# EAGLE schematic Rocketometer2148 MPU6050 (EAGLE 6.2)
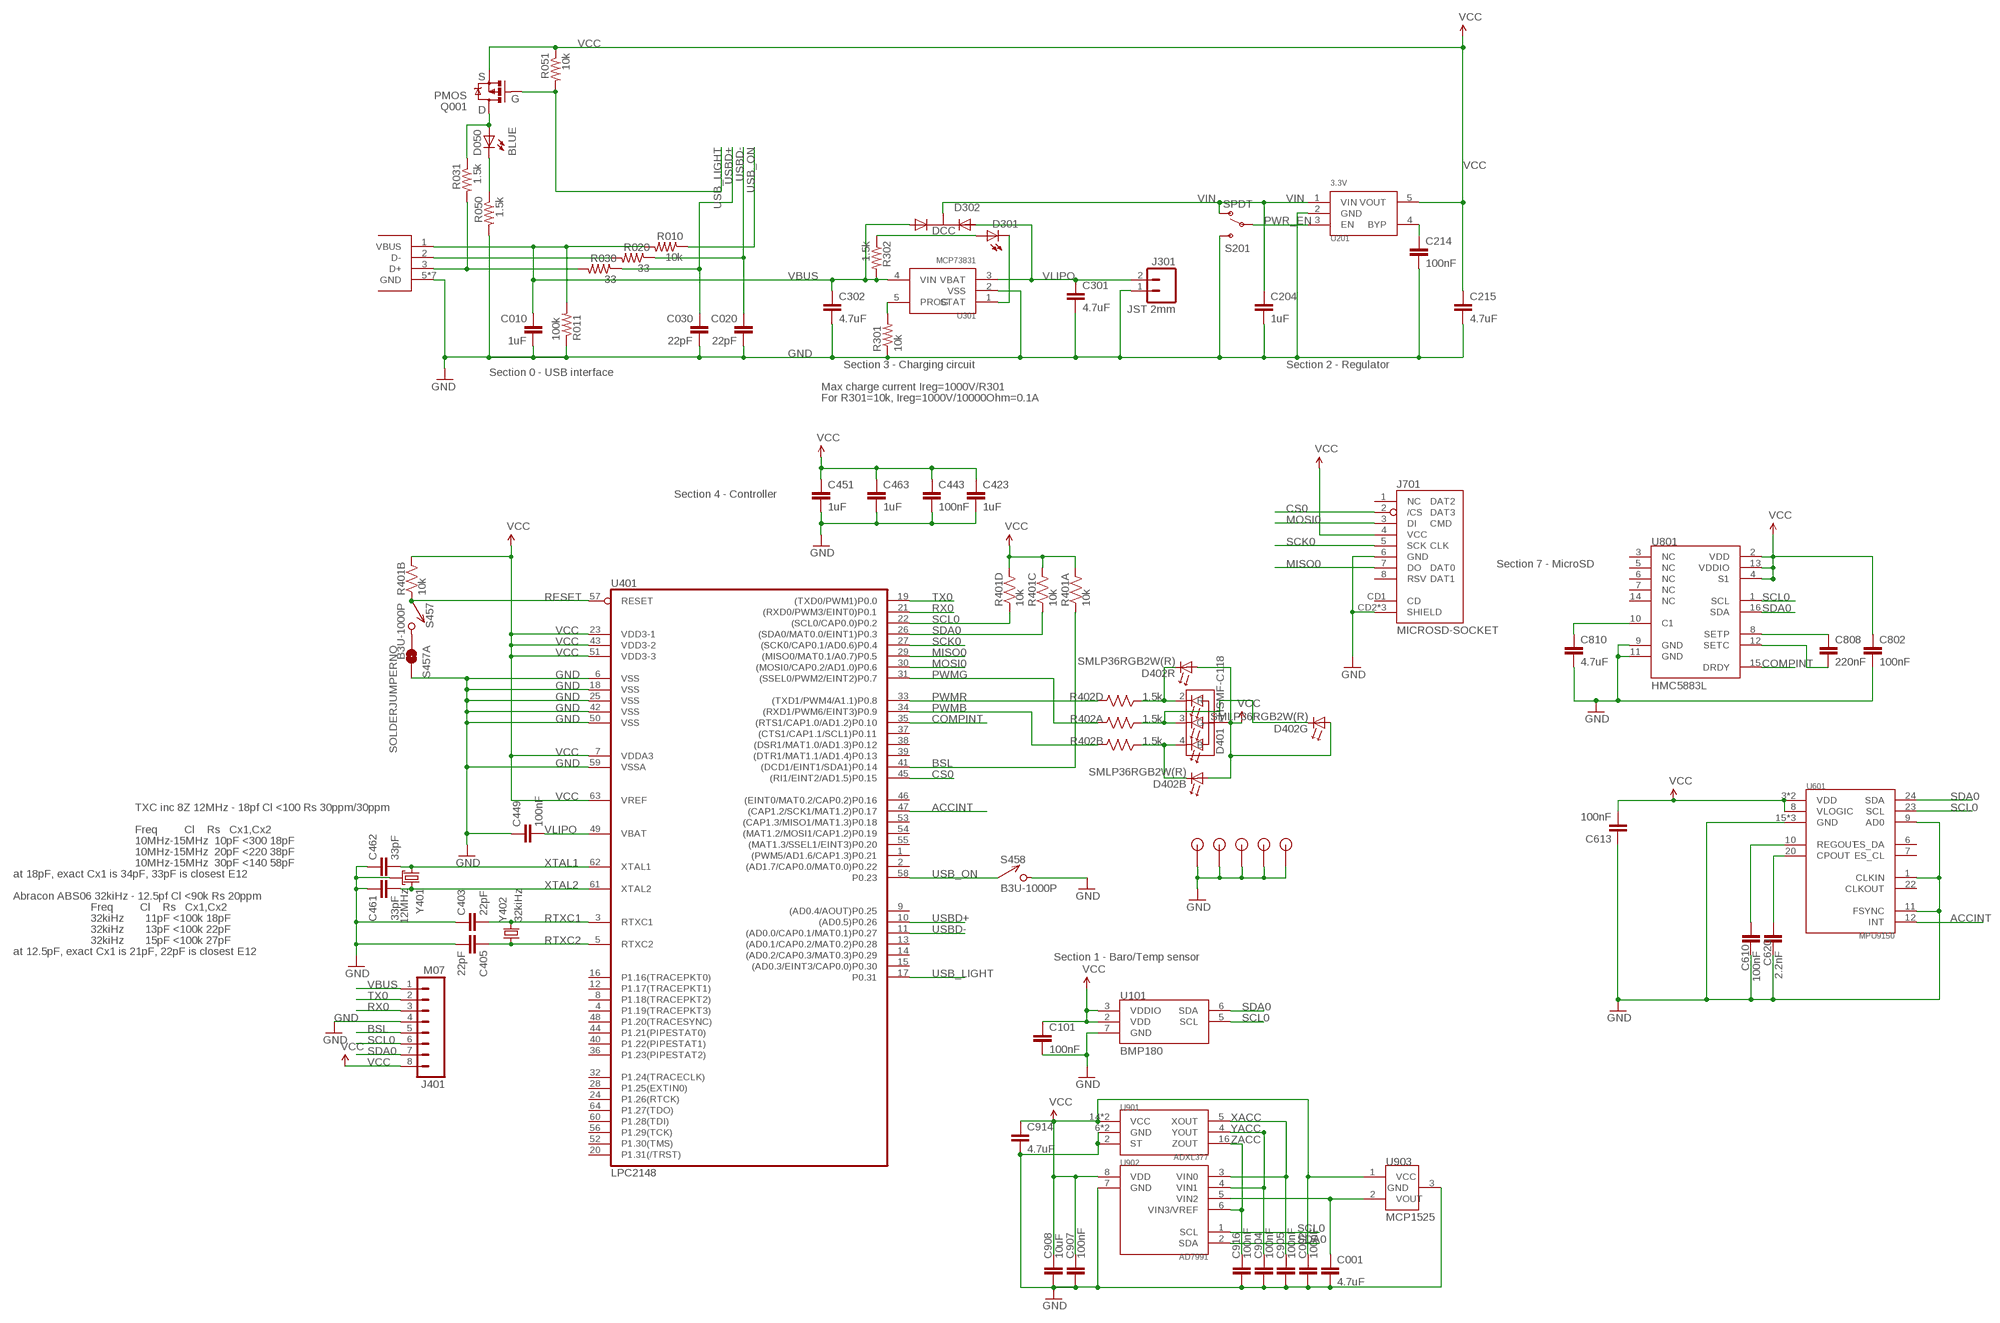
[diagram p0: schematic, sheet 1]

## Parts
C001  4.7uF  CAP0402-CAP  [0402-CAP]
C002  100nF  CAP0402-CAP  [0402-CAP]
C010  1uF  CAP0402-CAP  [0402-CAP]
C020  22pF  CAP0402-CAP  [0402-CAP]
C030  22pF  CAP0402-CAP  [0402-CAP]
C101  100nF  CAP0402-CAP  [0402-CAP]
C204  1uF  CAP0402-CAP  [0402-CAP]
C214  100nF  CAP0402-CAP  [0402-CAP]
C215  4.7uF  CAP0402-CAP  [0402-CAP]
C301  4.7uF  CAP0402-CAP  [0402-CAP]
C302  4.7uF  CAP0402-CAP  [0402-CAP]
C403  22pF  CAP0402-CAP  [0402-CAP]
C405  22pF  CAP0402-CAP  [0402-CAP]
C423  1uF  CAP0402-CAP  [0402-CAP]
C443  100nF  CAP0402-CAP  [0402-CAP]
C449  100nF  CAP0402-CAP  [0402-CAP]
C451  1uF  CAP0402-CAP  [0402-CAP]
C461  33pF  CAP0402-CAP  [0402-CAP]
C462  33pF  CAP0402-CAP  [0402-CAP]
C463  1uF  CAP0402-CAP  [0402-CAP]
C610  100nF  CAP0402-CAP  [0402-CAP]
C613  100nF  CAP0402-CAP  [0402-CAP]
C620  2.2nF  CAP0402-CAP  [0402-CAP]
C802  100nF  CAP0402-CAP  [0402-CAP]
C808  220nF  CAP0402-CAP  [0402-CAP]
C810  4.7uF  CAP0402-CAP  [0402-CAP]
C904  100nF  CAP0402-CAP  [0402-CAP]
C905  100nF  CAP0402-CAP  [0402-CAP]
C907  100nF  CAP0402-CAP  [0402-CAP]
C908  10uF  CAP0603-CAP  [0603-CAP]
C914  4.7uF  CAP0402-CAP  [0402-CAP]
C916  100nF  CAP0402-CAP  [0402-CAP]
D050  BLUE  LED0603  [LED-0603]
D301  YELLOW  LED0603  [LED-0603]
D302  DCC  PMEG2005CT  [SOT-23-3]
D401  HSMF-C118  [HSMF-C118]
D402  SMLP36RGB2W(R)  [SMLP36]
J001  USB_MICROB_JST  [UB-MC5BR3-SD204-4S]
J301  JST 2mm  M02-JST-2MM-SMT  [JST-2-SMD]
J401  M07  M081X08  [1X08]
J701  MICROSD-SOCKET  [MICROSD-SOCKET-PP]
JP1  STANDOFF  [STANDOFF]
JP2  STANDOFF  [STANDOFF]
JP3  STANDOFF  [STANDOFF]
JP4  STANDOFF  [STANDOFF]
JP5  STANDOFF  [STANDOFF]
Q001  PMOS  MOSFET-PCHANNELSMD  [SOT23-3]
R010  10k  RESISTOR0402-RES  [0402-RES]
R011  100k  RESISTOR0402-RES  [0402-RES]
R020  33  RESISTOR0402-RES  [0402-RES]
R030  33  RESISTOR0402-RES  [0402-RES]
R031  1.5k  RESISTOR0402-RES  [0402-RES]
R050  1.5k  RESISTOR0402-RES  [0402-RES]
R051  10k  RESISTOR0402-RES  [0402-RES]
R301  10k  RESISTOR0402-RES  [0402-RES]
R302  1.5k  RESISTOR0402-RES  [0402-RES]
R401  10k  RP404  [CRA04]
R402  1.5k  RP404  [CRA04]
S201  SPDT  SWITCH-SPSTSMD  [AYZ0202]
S457  B3U-1000P  [B3U-1000P]
S457A  SOLDERJUMPERNO  [SJ_2S-NO]
S458  B3U-1000P  [B3U-1000P]
U101  BMP180  [BMP180]
U201  3.3V  MIC5319D5  [SOT-23-5]
U301  MCP73831  [SOT-23-5]
U401  LPC2148  LPC213X  [SQFP-S-10X10-64]
U601  MPU9150  [LLGA24]
U801  HMC5883L  HMC5883LSMD  [16LPCC]
U901  ADXL377  [ADXL377]
U902  AD7991  AD799X  [SOT-23-8]
U903  MCP1525  [SOT-23-3]
Y401  12MHz  CX2520  [CRYSTAL_SMD_2MM_2_5MM]
Y402  32kiHz  ABS06  [ABS06]

## Nets
ACCINT: U401.47((CAP1.2/SCK1/MAT1.2)P0.17) U601.12(INT)
BSL: J401.5 R401.1 U401.41((DCD1/EINT1/SDA1)P0.14)
COMPINT: U401.35((RTS1/CAP1.0/AD1.2)P0.10) U801.15(DRDY)
CONN_D+: J001.3(D+) R030.2 R031.2
CONN_D-: J001.2(D-) R020.2
CS0: J701.2(/CS) U401.45((RI1/EINT2/AD1.5)P0.15)
GND [power]: C001.2 C002.2 C010.2 C020.2 C030.2 C101.2 C204.2 C214.2 C215.2 C301.2 C302.2 C403.1 C405.2 C423.2 C443.2 C449.1 C451.2 C461.1 C462.1 C463.2 C610.2 C613.1 C620.1 C802.2 C810.2 C904.2 C905.2 C907.2 C908.2 C914.2 C916.2 J001.5(GND) J001.P$6(GND) J001.P$7(GND) J001.P$8(GND) J001.P$9(GND) J001.P$10(GND) J001.P$11(GND) J301.1 J401.4 J701.6(GND) J701.CD2(SHIELD) J701.GND1(SHIELD) J701.GND3(SHIELD) JP1.P$1 JP2.P$1 JP3.P$1 JP4.P$1 JP5.P$1 R011.1 R050.2 R301.1 S201.3(S) S457A.2 S458.P$2 U101.7(GND) U201.2(GND) U301.2(VSS) U401.6(VSS) U401.18(VSS) U401.25(VSS) U401.42(VSS) U401.50(VSS) U401.59(VSSA) U601.1(CLKIN) U601.9(AD0) U601.11(FSYNC) U601.15(GND) U601.17(GND) U601.18(GND) U801.9(GND) U801.11(GND) U901.2(ST) U901.6(GND) U901.7(GND) U902.7(GND) U903.3(GND) Y401.2(GND) Y401.4(GND)
MISO0: J701.7(DO) U401.29((MISO0/MAT0.1/A0.7)P0.5)
MOSI0: J701.3(DI) U401.30((MOSI0/CAP0.2/AD1.0)P0.6)
N$1: C620.2 U601.20(CPOUT)
N$2: R301.2 U301.5(PROG)
N$4: D301.C U301.1(STAT)
N$5: D301.A R302.1
N$6: D050.A Q001.3(D) R031.1
N$7: D050.C R050.1
N$8: S457.P$2 S457A.1
N$10: C001.1 U902.5(VIN2) U903.2(VOUT)
N$13: C610.1 U601.10(REGOUT)
N$14: C808.1 U801.8(SETP)
N$15: C808.2 U801.12(SETC)
N$16: C810.1 U801.10(C1)
N$17: C214.1 U201.4(BYP)
PWMB: R402.7 U401.34((RXD1/PWM6/EINT3)P0.9)
PWMG: R402.8 U401.31((SSEL0/PWM2/EINT2)P0.7)
PWMR: R402.5 U401.33((TXD1/PWM4/A1.1)P0.8)
PWR_EN: S201.2(P) U201.3(EN)
QWMB: D401.4(B) D402.1(B:C) R402.2
QWMG: D401.3(G) D402.3(G:C) R402.1
QWMR: D401.2(R) D402.5(R:C) R402.4
RESET [power]: R401.2 S457.P$1 U401.57(RESET)
RTXC1: C403.2 U401.3(RTXC1) Y402.2
RTXC2: C405.1 U401.5(RTXC2) Y402.1
RX0: J401.3 U401.21((RXD0/PWM3/EINT0)P0.1)
SCK0: J701.5(SCK) U401.27((SCK0/CAP0.1/AD0.6)P0.4)
SCL0: J401.6 R401.4 U101.5(SCL) U401.22((SCL0/CAP0.0)P0.2) U601.23(SCL) U801.1(SCL) U902.1(SCL)
SDA0: J401.7 R401.3 U101.6(SDA) U401.26((SDA0/MAT0.0/EINT1)P0.3) U601.24(SDA) U801.16(SDA) U902.2(SDA)
TX0: J401.2 U401.19((TXD0/PWM1)P0.0)
USB_LIGHT: Q001.1(G) R051.2 U401.17(P0.31)
USB_ON: R010.1 S458.P$1 U401.58(P0.23)
USBD+: C030.1 R030.1 U401.10((AD0.5)P0.26)
USBD-: C020.1 R020.1 U401.11((AD0.0/CAP0.1/MAT0.1)P0.27)
VBUS: C010.1 C302.1 D302.1(A1) J001.1(VBUS) J401.1 R010.2 R011.2 R302.2 U301.4(VIN)
VCC [power]: C002.1 C101.1 C215.1 C423.1 C443.1 C451.1 C463.1 C613.2 C802.1 C907.1 C908.1 C914.1 D401.1(A) D402.2(B:A) D402.4(G:A) D402.6(R:A) J401.8 J701.4(VCC) Q001.2(S) R051.1 R401.5 R401.6 R401.7 R401.8 U101.2(VDD) U101.3(VDDIO) U201.5(VOUT) U401.7(VDDA3) U401.23(VDD3-1) U401.43(VDD3-2) U401.51(VDD3-3) U401.63(VREF) U601.3(VDD) U601.8(VLOGIC) U601.13(VDD) U801.2(VDD) U801.4(S1) U801.13(VDDIO) U901.14(VCC) U901.15(VCC) U902.8(VDD) U903.1(VCC)
VIN: C204.1 D302.3(K) S201.1(O) U201.1(VIN)
VLIPO: C301.1 C449.2 D302.2(A2) J301.2 U301.3(VBAT) U401.49(VBAT)
XACC: C905.1 U901.5(XOUT) U902.3(VIN0)
XTAL1: C462.2 U401.62(XTAL1) Y401.1
XTAL2: C461.2 U401.61(XTAL2) Y401.3
YACC: C904.1 U901.4(YOUT) U902.4(VIN1)
ZACC: C916.1 U901.16(ZOUT) U902.6(VIN3/VREF)
Unconnected: J701.1(NC) J701.8(RSV) J701.CD1(CD) R402.3 R402.6 U401.1((PWM5/AD1.6/CAP1.3)P0.21) U401.2((AD1.7/CAP0.0/MAT0.0)P0.22) U401.4(P1.19(TRACEPKT3)) U401.8(P1.18(TRACEPKT2)) U401.9((AD0.4/AOUT)P0.25) U401.12(P1.17(TRACEPKT1)) U401.13((AD0.1/CAP0.2/MAT0.2)P0.28) U401.14((AD0.2/CAP0.3/MAT0.3)P0.29) U401.15((AD0.3/EINT3/CAP0.0)P0.30) U401.16(P1.16(TRACEPKT0)) U401.20(P1.31(/TRST)) U401.24(P1.26(RTCK)) U401.28(P1.25(EXTIN0)) U401.32(P1.24(TRACECLK)) U401.36(P1.23(PIPESTAT2)) U401.37((CTS1/CAP1.1/SCL1)P0.11) U401.38((DSR1/MAT1.0/AD1.3)P0.12) U401.39((DTR1/MAT1.1/AD1.4)P0.13) U401.40(P1.22(PIPESTAT1)) U401.44(P1.21(PIPESTAT0)) U401.46((EINT0/MAT0.2/CAP0.2)P0.16) U401.48(P1.20(TRACESYNC)) U401.52(P1.30(TMS)) U401.53((CAP1.3/MISO1/MAT1.3)P0.18) U401.54((MAT1.2/MOSI1/CAP1.2)P0.19) U401.55((MAT1.3/SSEL1/EINT3)P0.20) U401.56(P1.29(TCK)) U401.60(P1.28(TDI)) U401.64(P1.27(TDO)) U601.6(ES_DA) U601.7(ES_CL) U601.22(CLKOUT) U801.3(NC) U801.5(NC) U801.6(NC) U801.7(NC) U801.14(NC)

## Notes on the sheet
- S
- G
- D
- Section 0 - USB interface | Section 3 - Charging circuit | Section 2 - Regulator
- Max charge current Ireg=1000V/R301
- For R301=10k, Ireg=1000V/10000Ohm=0.1A
- Section 4 - Controller
- Section 7 - MicroSD
- TXC inc 8Z 12MHz - 18pf Cl <100 Rs 30ppm/30ppm
- Freq         Cl    Rs   Cx1,Cx2
- 10MHz-15MHz  10pF <300 18pF
- 10MHz-15MHz  20pF <220 38pF
- 10MHz-15MHz  30pF <140 58pF
- at 18pF, exact Cx1 is 34pF, 33pF is closest E12
- Abracon ABS06 32kiHz - 12.5pf Cl <90k Rs 20ppm
- Freq         Cl    Rs   Cx1,Cx2
- 32kiHz       11pF <100k 18pF
- 32kiHz       13pF <100k 22pF
- 32kiHz       15pF <100k 27pF
- at 12.5pF, exact Cx1 is 21pF, 22pF is closest E12
- Section 1 - Baro/Temp sensor

## Library data of the parts
C001 C215 C301 C302 C810 C914 = SparkFun:CAP: Capacitor Standard 0603 ceramic capacitor, and 0.1" leaded capacitor.; DIGIKEY: 445-7395-1-ND
C002 C907 = SparkFun-Passives:CAP: Capacitor Standard 0603 ceramic capacitor, and 0.1" leaded capacitor.; DIGIKEY: 445-1265-1-ND
C010 C204 C423 C451 C463 = SparkFun:CAP: Capacitor Standard 0603 ceramic capacitor, and 0.1" leaded capacitor.; DIGIKEY: 445-4114-1-ND
C020 C030 C403 C405 = SparkFun:CAP: Capacitor Standard 0603 ceramic capacitor, and 0.1" leaded capacitor.; DIGIKEY: 445-1239-1-ND
C101 C214 C443 C449 C610 C613 C802 C904 C905 C916 = SparkFun:CAP: Capacitor Standard 0603 ceramic capacitor, and 0.1" leaded capacitor.; DIGIKEY: 445-1265-1-ND
C461 C462 = SparkFun:CAP: Capacitor Standard 0603 ceramic capacitor, and 0.1" leaded capacitor.; DIGIKEY: 445-1241-1-ND
C620 = SparkFun:CAP: Capacitor Standard 0603 ceramic capacitor, and 0.1" leaded capacitor.; DIGIKEY: 445-1257-1-ND
C808 = SparkFun:CAP: Capacitor Standard 0603 ceramic capacitor, and 0.1" leaded capacitor.; DIGIKEY: 445-5938-1-ND
C908 = SparkFun:CAP: Capacitor Standard 0603 ceramic capacitor, and 0.1" leaded capacitor.; DIGIKEY: 445-7486-1-ND
D050 = SparkFun:LED: LEDs Standard schematic elements and footprints for 5mm, 3mm, 1206, and 0603 sized LEDs. 5mm - Spark Fun Electronics SKU : COM-00529 (and others); DIGIKEY: 350-2037-1-ND
D301 = SparkFun:LED: LEDs Standard schematic elements and footprints for 5mm, 3mm, 1206, and 0603 sized LEDs. 5mm - Spark Fun Electronics SKU : COM-00529 (and others); DIGIKEY: 350-2032-1-ND
D302 = KwanSystems:PMEG2005CT; DIGIKEY: 568-6500-1-ND
D401 = KwanSystems:HSMF-C118; DIGIKEY: 516-1778-1-ND
D402 = KwanSystems:SMLP36RGB2W(R)
J001 = KwanSystems:USB_MICROB_JST; DIGIKEY: 455-2562-1-ND
J301 = SparkFun:M02: Header 2 Standard 2-pin 0.1" header. Use with straight break away headers (SKU : PRT-00116), right angle break away headers (PRT-00553), swiss pins (PRT-00743), machine pins (PRT-00117), and female headers (PRT-00115). Molex polarized connector foot print use with SKU : PRT-08233 with associated crimp pins and housings.; DIGIKEY: 455-1749-1-ND
J401 = SparkFun-Connectors:M08: Header 8 Standard 8-pin 0.1" header. Use with straight break away headers (SKU : PRT-00116), right angle break away headers (PRT-00553), swiss pins (PRT-00743), machine pins (PRT-00117), and female headers (PRT-00115).; DIGIKEY: $NOPART
J701 = KwanSystems:MICROSD-SOCKET: microSD Socket Push-push type uSD socket. Digikey 101-00660-68-6-1-ND. tDoc lines correctly indicate media card edge positions when inserting (unlocked, locked, depressed).; DIGIKEY: 101-00581-59-1-ND
JP1-JP5 = KwanSystems:STANDOFF; DIGIKEY: $NOPART
Q001 = SparkFun-DiscreteSemi:MOSFET-PCHANNEL: Generic PMOSFET
R010 R051 R301 = SparkFun:RESISTOR: Resistor Basic schematic elements and footprints for 0603, 1206, and PTH resistors.; DIGIKEY: P10.0KLCT-ND
R011 = SparkFun:RESISTOR: Resistor Basic schematic elements and footprints for 0603, 1206, and PTH resistors.; DIGIKEY: P100KLCT-ND
R020 R030 = SparkFun:RESISTOR: Resistor Basic schematic elements and footprints for 0603, 1206, and PTH resistors.; DIGIKEY: P33.0LCT-ND
R031 R050 R302 = SparkFun:RESISTOR: Resistor Basic schematic elements and footprints for 0603, 1206, and PTH resistors.; DIGIKEY: P1.50KLCT-ND
R401 = KwanSystems:RP4; DIGIKEY: CRA4S810KCT-ND
R402 = KwanSystems:RP4; DIGIKEY: CRA4S81.5KCT-ND
S201 = SparkFun:SWITCH-SPST: SPST Switch Simple slide switch. Spark Fun Electronics SKU : COM-00102; DIGIKEY: 401-2013-1-ND
S457 S458 = KwanSystems:B3U-1000P; DIGIKEY: SW1020CT-ND
S457A = SparkFun-Passives:SOLDERJUMPER: Solder Jumper Standard SMD solder jumper. Used to automate production. Two varients : Normally Open and Normally Closed are the same, but have different paste layers. NC will have a large amount of paste and should jumper during reflow.; DIGIKEY: $NOPART
U101 = KwanSystems:BMP180; DIGIKEY: 828-1027-1-ND
U201 = KwanSystems:MIC5319; DIGIKEY: 576-1910-1-ND
U301 = KwanSystems:MCP73831; DIGIKEY: 576-1910-1-ND
U401 = SparkFun:LPC213X: LPC213x Schematic element and footprint for NXP LPC213x. Spark Fun Electronics SKU : COM-00520; DIGIKEY: 568-1765-ND
U601 = KwanSystems:MPU9150
U801 = SparkFun:HMC5883L: 3 Axis Digital Compass IC; DIGIKEY: 342-1082-1-ND; LABEL_3D50: 5883
U901 = KwanSystems:ADXL377; DIGIKEY: ADXL377BCPZ-RL7CT-ND
U902 = KwanSystems:AD799X; DIGIKEY: AD7991YRJZ-0500RL7CT-ND
U903 = KwanSystems:MCP1525
Y401 = KwanSystems:CX2520
Y402 = KwanSystems:ABS06; DIGIKEY: 535-10104-1-ND

## Net classes
0 default: width 0.152 mm, drill 0.33 mm, clearance 0.152 mm
1 power: width 0.152 mm, drill 0.33 mm, clearance 0.152 mm to class 0, clearance 0.152 mm
2 hv: width 0.152 mm, drill 0.33 mm, clearance 0.152 mm to class 0, clearance 0.152 mm to class 1, clearance 0.152 mm